# EAGLE schematic S_B_block_base (EAGLE 9.6.2)
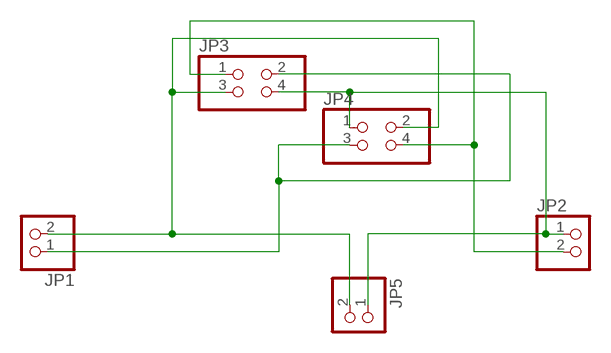
[diagram p0: schematic, sheet 1]

## Parts
JP1  PINHD-1X2  [1X02]
JP2  PINHD-1X2  [1X02]
JP3  PINHD-2X2  [2X02]
JP4  PINHD-2X2  [2X02]
JP5  PINHD-1X2  [1X02]

## Nets
GND: JP2.1 JP3.4 JP4.1 JP5.1
SCL: JP1.2 JP3.3 JP4.2 JP5.2
SDA: JP1.1 JP3.2 JP4.3
VDD: JP2.2 JP3.1 JP4.4

## Library data of the parts
JP1 JP2 JP5 = pinhead2:PINHD-1X2: PIN HEADER
JP3 JP4 = pinhead2:PINHD-2X2: PIN HEADER